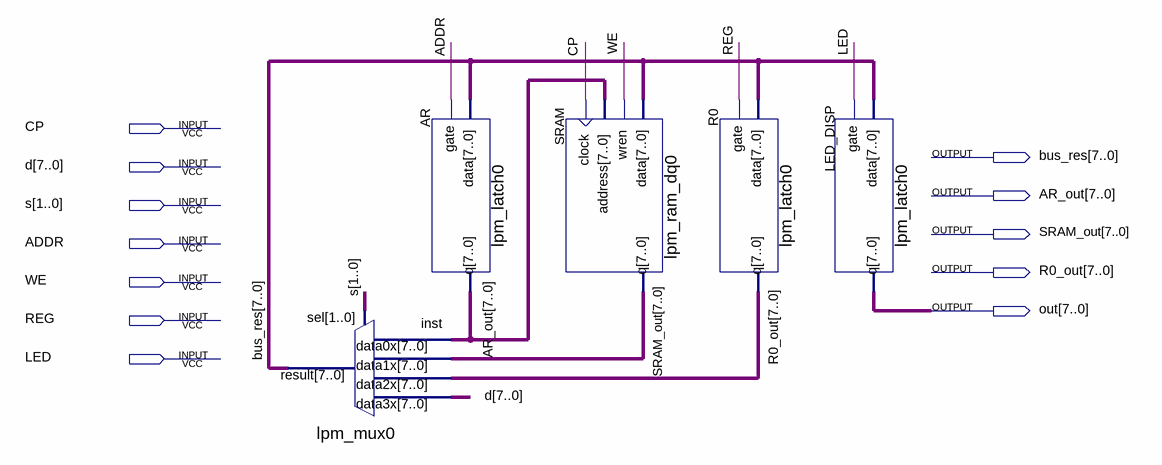
[diagram p0: schematic sheet]
// Quartus schematic lab5.bdf as structural Verilog: 5 symbols, 12 pins
module lab5 (
  input  CP,
  input  [7:0] d,
  input  [1:0] s,
  input  ADDR,
  input  WE,
  input  REG,
  input  LED,
  output [7:0] bus_res,
  output [7:0] AR_out,
  output [7:0] SRAM_out,
  output [7:0] R0_out,
  output [7:0] out
);

  lpm_mux0 inst (.data3x(d), .data2x(R0_out), .data1x(SRAM_out), .data0x(AR_out), .sel(s), .result(bus_res));
  lpm_latch0 AR (.data(bus_res), .gate(ADDR), .q(AR_out));
  lpm_ram_dq0 SRAM (.data(bus_res), .wren(WE), .address(AR_out), .clock(CP), .q(SRAM_out));
  lpm_latch0 R0 (.data(bus_res), .gate(REG), .q(R0_out));
  lpm_latch0 LED_DISP (.data(bus_res), .gate(LED), .q(out));
endmodule
